# EAGLE design leaf-heater-controller-rev2 (EAGLE 9.0.1)
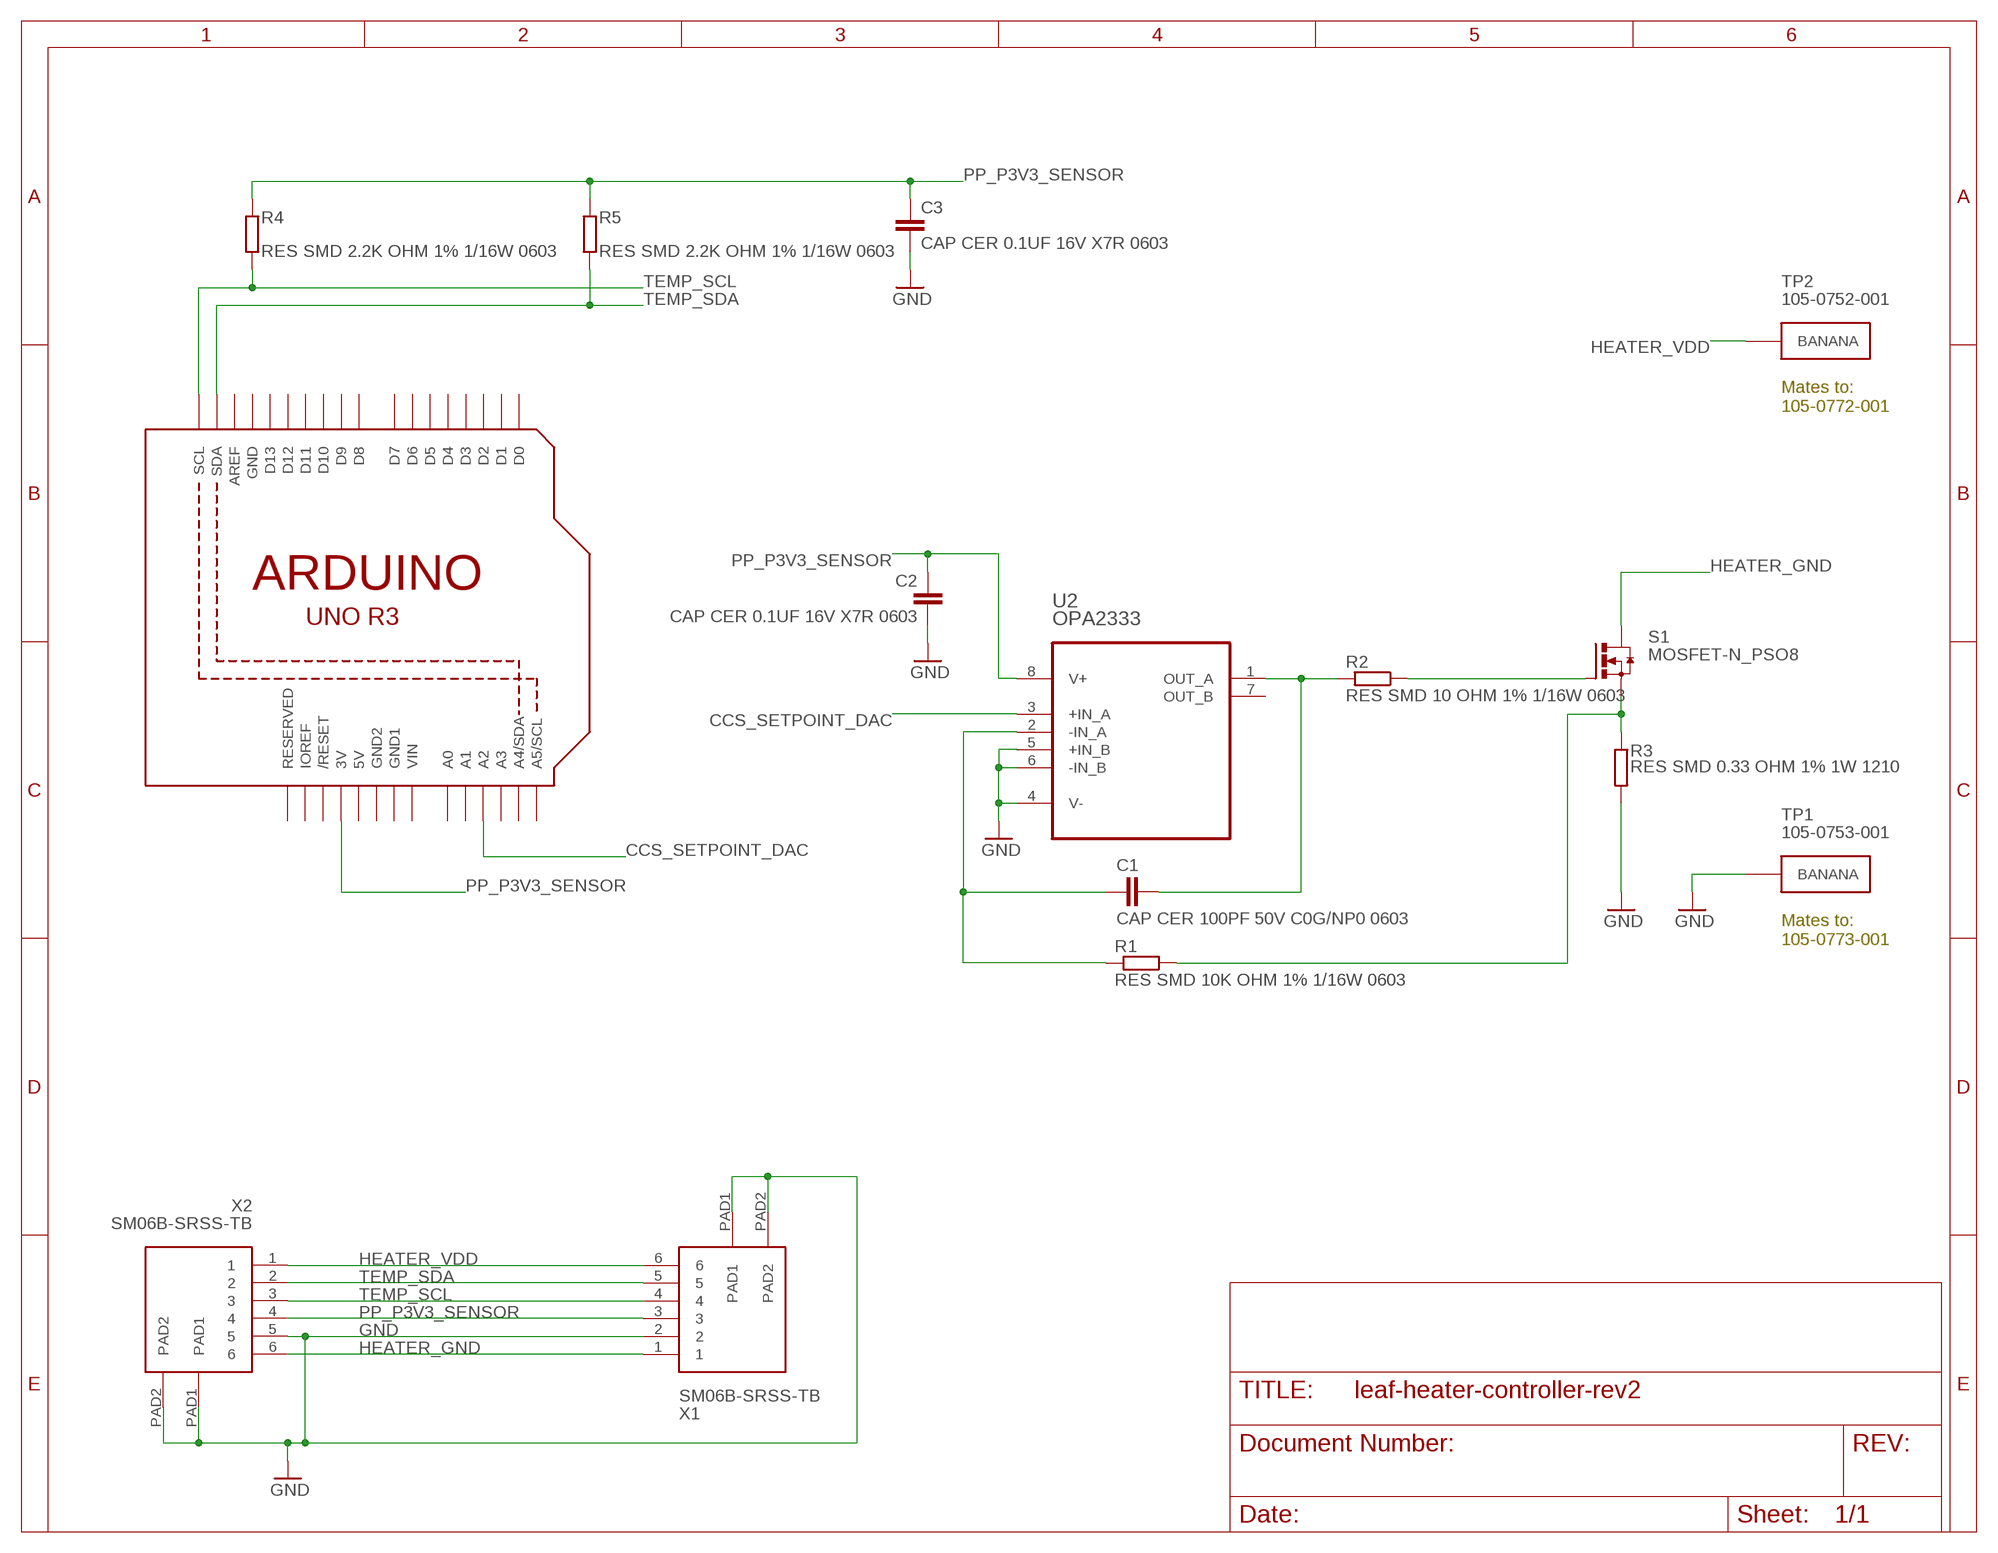
[diagram p0: schematic, sheet 1]

## Parts
C1  CAP CER 100PF 50V C0G/NP0 0603  C-EUC0603  [C0603]
C2  CAP CER 0.1UF 16V X7R 0603  C-EUC0603  [C0603]
C3  CAP CER 0.1UF 16V X7R 0603  C-EUC0603  [C0603]
R1  RES SMD 10K OHM 1% 1/16W 0603  R-EU_R0603  [R0603]
R2  RES SMD 10 OHM 1% 1/16W 0603  R-EU_R0603  [R0603]
R3  RES SMD 0.33 OHM 1% 1W 1210  R-EU_R1210  [R1210]
R4  RES SMD 2.2K OHM 1% 1/16W 0603  R-EU_R0603  [R0603]
R5  RES SMD 2.2K OHM 1% 1/16W 0603  R-EU_R0603  [R0603]
S1  MOSFET-N_PSO8  [POWERSO8]
TP1  105-0753-001  CINCH-BANANA  [CINCH-BANANA-105-075X-001]
TP2  105-0752-001  CINCH-BANANA  [CINCH-BANANA-105-075X-001]
U1  ARDUINOR3-DIMENSION  [ARDUINOR3]
U2  OPA2333  OPA2333AID  [SOIC127P600X175-8N]
X1  SM06B-SRSS-TB  JST-SH-6PIN  [JST-SM06B-SRSS-TB]
X2  SM06B-SRSS-TB  JST-SH-6PIN  [JST-SM06B-SRSS-TB]

## Nets
CCS_SETPOINT_DAC: U1.A2 U2.3(+IN_A)
GND: C2.2 C3.2 R3.2 TP1.1(BANANA) TP1.2(BANANA) U2.4(V-) U2.5(+IN_B) U2.6(-IN_B) X1.2 X1.PAD1 X1.PAD2 X2.5 X2.PAD1 X2.PAD2
HEATER_GND: S1.5(D) S1.6(D) S1.7(D) S1.8(D) S1.D X1.1 X2.6
HEATER_VDD: TP2.1(BANANA) TP2.2(BANANA) X1.6 X2.1
N$1: C1.2 R2.2 U2.1(OUT_A)
N$2: C1.1 R1.2 U2.2(-IN_A)
N$3: R2.1 S1.4(G)
N$4: R1.1 R3.1 S1.1(S) S1.2(S) S1.3(S)
PP_P3V3_SENSOR: C2.1 C3.1 R4.2 R5.2 U1.3V U2.8(V+) X1.3 X2.4
TEMP_SCL: R4.1 U1.SCL X1.4 X2.3
TEMP_SDA: R5.1 U1.SDA X1.5 X2.2
Unconnected: U1.A0 U1.A1 U1.A3 U1.A4(A4/SDA) U1.A5(A5/SCL) U1.AREF U1.D0 U1.D1 U1.D2 U1.D3 U1.D4 U1.D5 U1.D6 U1.D7 U1.D8 U1.D9 U1.D10 U1.D11 U1.D12 U1.D13 U1.IOREF U1.RESERVED U1.RESET(/RESET) U2.7(OUT_B)

## Notes on the sheet
- Mates to:
  105-0772-001
- Mates to:
  105-0773-001

## Power pins joined to a net without a drawn wire
5V: U1.5V
GND: U1.GND
GND1: U1.GND1
GND2: U1.GND2
VIN: U1.VIN

## Library data of the parts
C1-C3 = rcl-modified-footprints:C-EU: CAPACITOR, European symbol
R1-R5 = rcl-modified-footprints:R-EU_: RESISTOR, European symbol
S1 = sc_usercreated:MOSFET-N_PSO8
TP1 TP2 = meng-plant-raman:CINCH-BANANA; VALUE: 105-075X-001
U1 = adafruit:ARDUINOR3: This is a new object for the new Arduino R3 - with extra pins that you may want to use (such as IOref, and duplicated A4/A5
U2 = Texas Instruments_By_element14_Batch_1:OPA2333AID: 1.8V, microPOWER CMOS OPERATIONAL AMPLIFIERS Zerø-Drift Series; MPN: OPA2333AID; OC_FARNELL: -; OC_NEWARK: 80K2645; PACKAGE: SOIC-8; SUPPLIER: Texas Instruments
X1 X2 = meng-plant-raman:JST-SH-6PIN

## Board
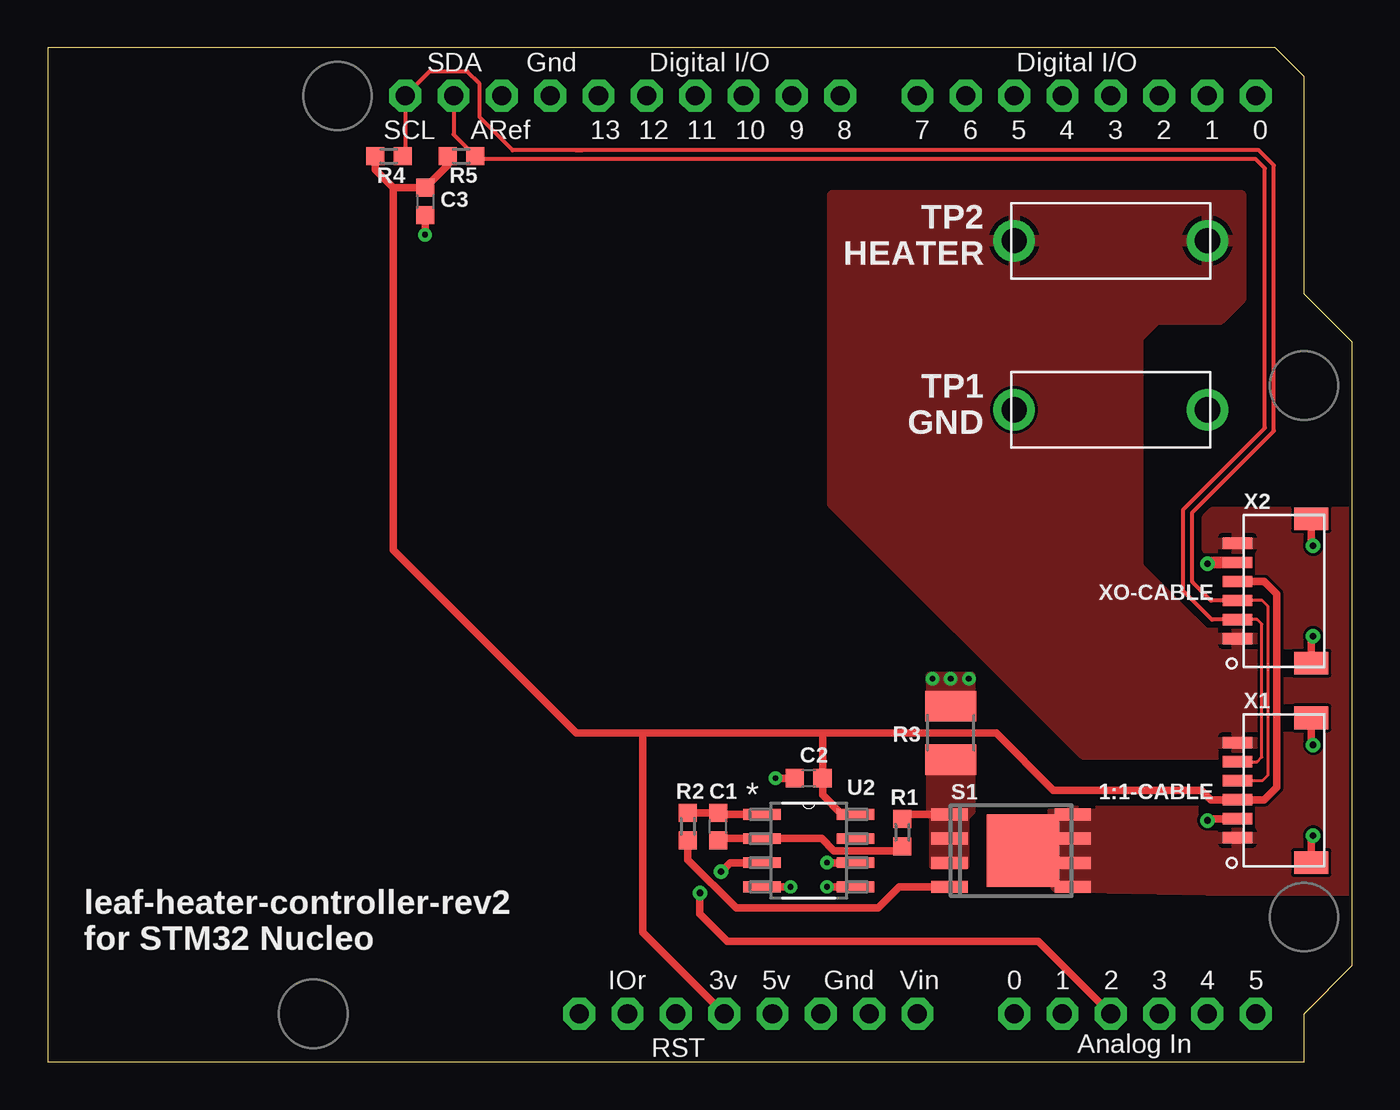
[diagram p1: board, top side]
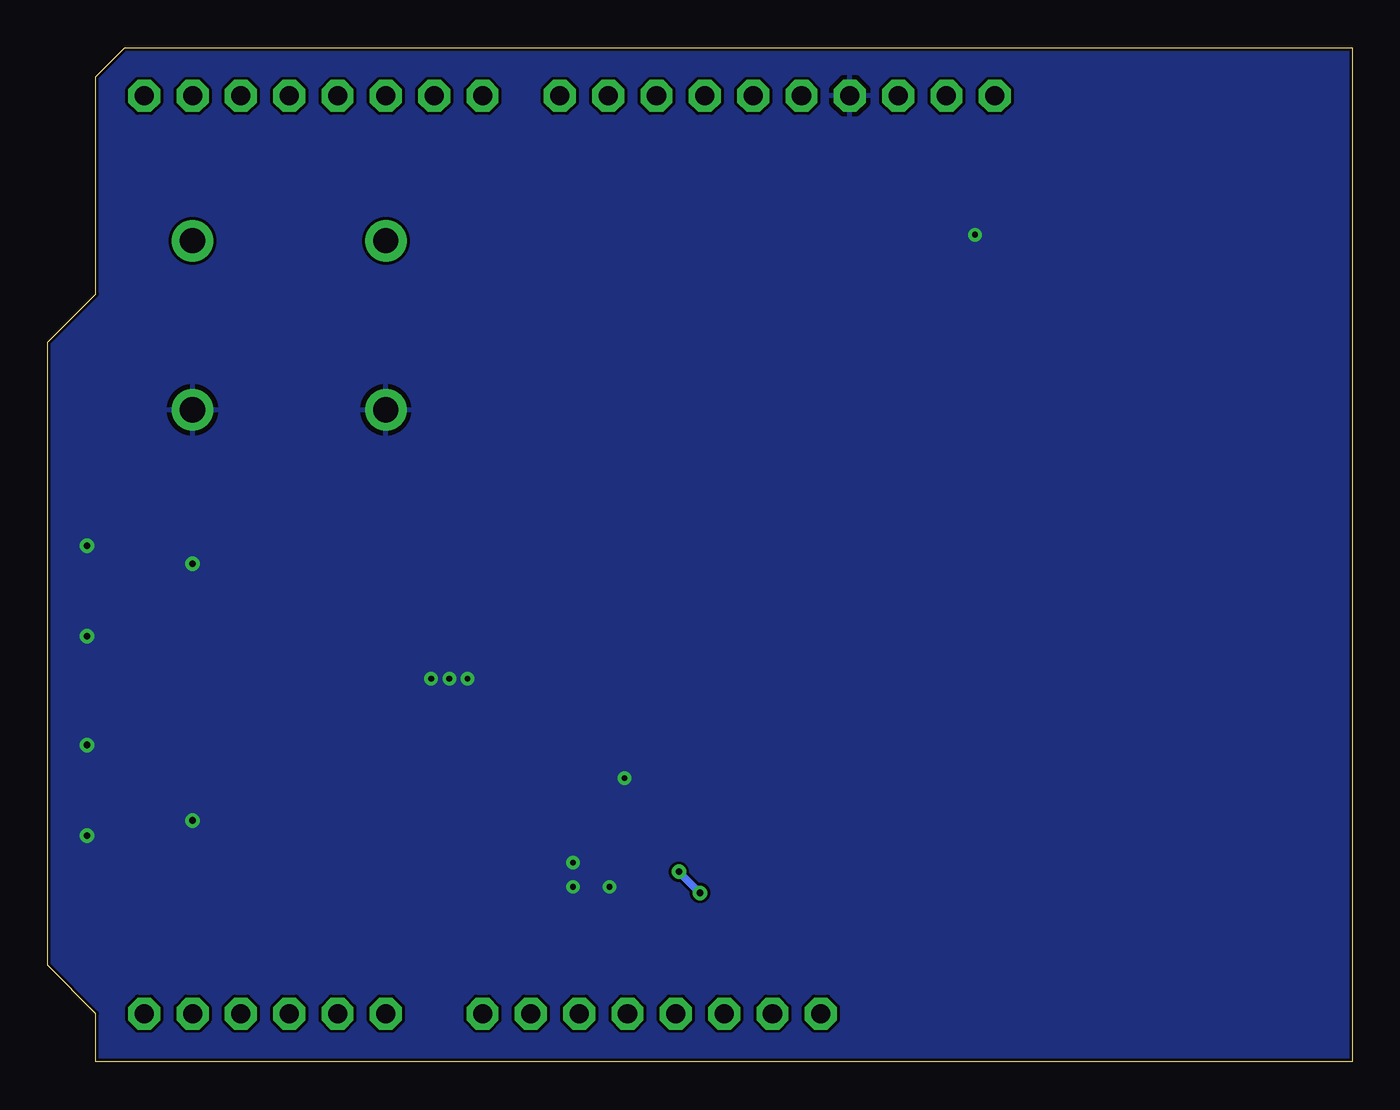
[diagram p2: board, bottom side, seen from below]

Size 68.58 x 53.34 mm. Coordinates in mm from the lower left corner, seen from the top.
Copper layers (1*16): Top 0.035mm / dielectric 1.5mm / Bottom 0.035mm
Design rules "default *": minimum track width 6mil, minimum drill 0.3mm, track to track 6mil, track to pad 6mil, pad to pad 6mil, via to via 6mil, smd to smd 6mil, copper to edge 6mil, drill to drill 6mil, minimum pad ring 10mil, minimum via ring 8mil, stop-mask expansion 2mil, vias tented up to drill 0mil, thermal gap 10mil

### Footprints (pad centres in the part's own frame; a part is rotated, then mirrored left to right if it is on the bottom)
C0603 = smd 0.95 x 0.95: 1 -0.725,0; 2 0.725,0
R0603 = smd 0.95 x 0.95: 1 -0.725,0; 2 0.725,0
R1210 = smd 1.6 x 2.7: 1 -1.4,0; 2 1.4,0
POWERSO8 = smd 0.635 x 1.905: 1 -1.905,-3.235; 2 -0.635,-3.235; 3 0.635,-3.235; 4 1.905,-3.235; 5 1.905,3.235; 6 0.635,3.235; 7 -0.635,3.235; 8 -1.905,3.235 | smd 3.81 x 3.81: D 0,0.635
CINCH-BANANA-105-075X-001 = drill 1.321 pad 2.184: 1 5.08,0; 2 -5.08,0
ARDUINOR3 = drill 1 pad 1.676 octagon: 3V 35.56,2.54; 5V 38.1,2.54; A0 50.8,2.54; A1 53.34,2.54; A2 55.88,2.54; A3 58.42,2.54; A4 60.96,2.54; A5 63.5,2.54; AREF 23.876,50.8; D0 63.5,50.8; D1 60.96,50.8; D2 58.42,50.8; D3 55.88,50.8; D4 53.34,50.8; D5 50.8,50.8; D6 48.26,50.8; D7 45.72,50.8; D8 41.656,50.8; D9 39.116,50.8; D10 36.576,50.8; D11 34.036,50.8; D12 31.496,50.8; D13 28.956,50.8; GND 26.416,50.8; GND1 43.18,2.54; GND2 40.64,2.54; IOREF 30.48,2.54; RESERVED 27.94,2.54; RESET 33.02,2.54; SCL 18.796,50.8; SDA 21.336,50.8; VIN 45.72,2.54
SOIC127P600X175-8N = smd 1.981 x 0.559: 1 -2.464,1.905; 2 -2.464,0.635; 3 -2.464,-0.635; 4 -2.464,-1.905; 5 2.464,-1.905; 6 2.464,-0.635; 7 2.464,0.635; 8 2.464,1.905
JST-SM06B-SRSS-TB = smd 0.6 x 1.55: 1 -2.5,4.775; 2 -1.5,4.775; 3 -0.5,4.775; 4 0.5,4.775; 5 1.5,4.775; 6 2.5,4.775 | smd 1.2 x 1.8: PAD1 3.8,0.9; PAD2 -3.8,0.9

### Placement (x,y rotation side)
C1  35.24,12.38 90 top
C2  40.01,14.92 180 top
C3  19.84,45.24 270 top
R1  44.93,12.06 270 top
R2  33.66,12.38 90 top
R3  47.47,17.3 90 top
R4  17.94,47.62 180 top
R5  21.75,47.62 180 top
S1  50.64,11.11 270 top
TP1  55.88,34.29 0 top
TP2  55.88,43.18 0 top
U1  0,0 0 top
U2  40.01,11.11 0 top
X1  67.31,14.29 90 top
X2  67.31,24.77 90 top

### Tracks (layer width: path | path; a pad name or v marks a point on that pad's centre or on a via)
CCS_SETPOINT_DAC  (via drill 0.35)
  Top 0.406: U1.A2 52.07,6.35 35.72,6.35 34.29,7.78 v34.29,8.89 | U2.3 35.88,10.48 v35.4,10
  Bottom 0.406: v34.29,8.89 v35.4,10
GND  (via drill 0.3, 0.35)
  Top 0.406: C3.2 v19.84,43.5 | v60.96,12.7 61.05,12.79 X1.2 | X1.PAD2 66.41,11.8 v66.52,11.91 | X1.PAD1 66.41,16.77 v66.52,16.67 | X2.PAD1 66.41,27.25 v66.52,27.15 | X2.PAD2 66.41,22.28 v66.52,22.38 | U2.6 v40.96,10.48 | U2.5 v40.96,9.21 | U2.4 v39.05,9.21 | C2.2 v38.26,14.92
  Top 0.61: X2.5 61.03,26.27 v60.96,26.19
  other vias: 46.51,20.16 47.47,20.16 48.42,20.16
  pour Bottom: 0,0 0,53.98 69.85,53.98 69.85,0
  pour Top (no thermals): 46.35,18.41 46.35,20.32 48.58,20.32 48.58,18.41
HEATER_GND
  Top 0.406: S1.7 51.91,11.75 S1.D
  pour Top: 60.96,28.57 61.28,28.89 68.58,28.89 68.58,9.05 60.96,9.05 53.02,9.21 52.86,13.18 62.07,13.18 64.61,15.72 64.61,24.13 61.75,26.99 60.96,26.99
  pour Top (no thermals): 53.34,13.02 53.02,12.7 53.02,9.37 53.34,9.05 54.93,9.05 55.24,9.37 55.24,12.7 54.93,13.02
HEATER_VDD
  pour Top (rank 3): 62.71,45.56 62.71,40.16 61.59,39.05 58.26,39.05 57.31,38.1 57.31,26.04 60.8,22.54 63.66,22.54 63.66,16.19 54.45,16.19 41.27,29.37 41.27,45.56
N$1
  Top 0.406: U2.1 35.33,13.02 C1.2 R2.2
N$2
  Top 0.406: C1.1 35.33,11.75 U2.2 40.7,11.75 41.33,11.11 44.7,11.11 R1.2
N$3
  Top 0.406: R2.1 33.66,10.64 36.2,8.1 43.66,8.1 44.77,9.21 S1.4
N$4
  Top 0.406: S1.1 45.15,13.02 R1.1
  pour Top (no thermals): 46.35,16.35 46.35,13.02 46.51,12.86 46.51,10.32 48.26,10.32 48.26,12.86 48.58,13.18 48.58,16.35
PP_P3V3_SENSOR
  Top 0.406: X2.4 63.95,25.27 64.61,24.61 64.61,14.45 63.95,13.79 X1.3 61.14,13.79 60.64,14.29 52.86,14.29 49.85,17.3 40.8,17.3 | U2.8 41.75,13.02 40.73,14.04 C2.1 40.73,17.23 40.8,17.3 | R5.2 21.02,47.15 C3.1 18.17,45.97 | R4.2 17.21,46.92 18.17,45.97 | 31.27,17.3 27.78,17.3 18.17,26.92 18.17,45.97 | 40.8,17.3 31.27,17.3 | U1.3V 31.27,6.83 31.27,17.3
TEMP_SCL
  Top 0.152: X2.3 63.84,24.27 64.14,23.97 64.14,15.08 63.84,14.79 X1.4
  Top 0.203: X2.3 61.14,24.27 60.17,25.24 60.17,28.89 64.45,33.18 64.45,47.15 63.66,47.94 27.78,47.94 | 27.78,47.94 28.1,47.94 | 27.78,47.94 24.45,47.94 22.7,49.69 22.7,51.44 22.07,52.07 20.07,52.07 U1.SCL 18.8,47.76 R4.1
TEMP_SDA
  Top 0.152: X1.5 63.57,15.79 63.82,16.03 63.82,23.02 63.57,23.27 X2.2
  Top 0.203: X2.2 61.19,23.27 59.69,24.77 59.69,29.05 63.98,33.34 63.98,46.99 63.5,47.47 22.63,47.47 R5.1 21.34,48.76 U1.SDA

### Text on the board
tPlace: HEATER | GND | XO-CABLE | 1:1-CABLE | leaf-heater-controller-rev2 / for STM32 Nucleo